# EAGLE design untitled (EAGLE 9.5.0)
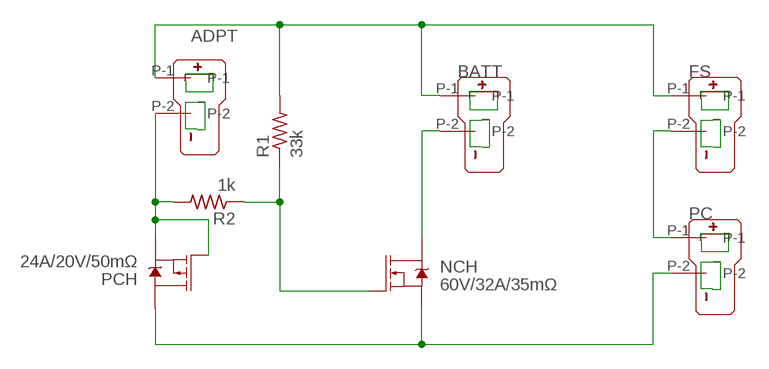
[diagram p0: schematic, sheet 1]

## Parts
ADPT  T-PLUG_CONNECTOR  [T_PLUG_CONNECTOR]
BATT  T-PLUG_CONNECTOR  [T_PLUG_CONNECTOR]
FS  T-PLUG_CONNECTOR  [T_PLUG_CONNECTOR]
NCH  60V/32A/35mΩ  MOSFET-NCH-FQP30N06L  [TO220V]
PC  T-PLUG_CONNECTOR  [T_PLUG_CONNECTOR]
PCH  24A/20V/50mΩ  MOSFET_PCH-NDP6020P  [TO220V]
R1  33k  R-US_0411/15  [0411/15]
R2  1k  R-US_0411/15  [0411/15]

## Nets
GND: NCH.3(S) PC.P-2 PCH.2(D)
N$1: NCH.1(G) R1.1 R2.1
N$2: ADPT.P-2 PCH.1(G) PCH.3(S) R2.2
N$4: BATT.P-2 NCH.2(D)
N$5: ADPT.P-1 BATT.P-1 FS.P-1 R1.2
N$6: FS.P-2 PC.P-1

## Library data of the parts
ADPT BATT FS PC = con-T-plug:T-PLUG_CONNECTOR
NCH = SparkFun-DiscreteSemi:MOSFET-NCH: N-channel MOSFETs Voltage controlled devices that allow control of high current outputs. SparkFun Products: SparkFun OpenScale <https://www.sparkfun.com/products/13261> SparkFun Digital Sandbox <https://www.sparkfun.com/products/12651> SparkFun Monster Moto Shield <https://www.sparkfun.com/products/10182> SparkFun MOSFET Power Controller <https://www.sparkfun.com/products/11214>; PROD_ID: TRANS-10060
PCH = SparkFun-DiscreteSemi:MOSFET_PCH: P-channel MOSFETs Voltage controlled devices that allow control of high current outputs. SparkFun Products: SparkFun ESP32 Thing <https://www.sparkfun.com/products/13907> SparkFun ESP8266 Thing <https://www.sparkfun.com/products/13231>; PROD_ID: TRANS-13060
R1 R2 = rcl:R-US_: RESISTOR, American symbol; SPICEPREFIX: R

## Board
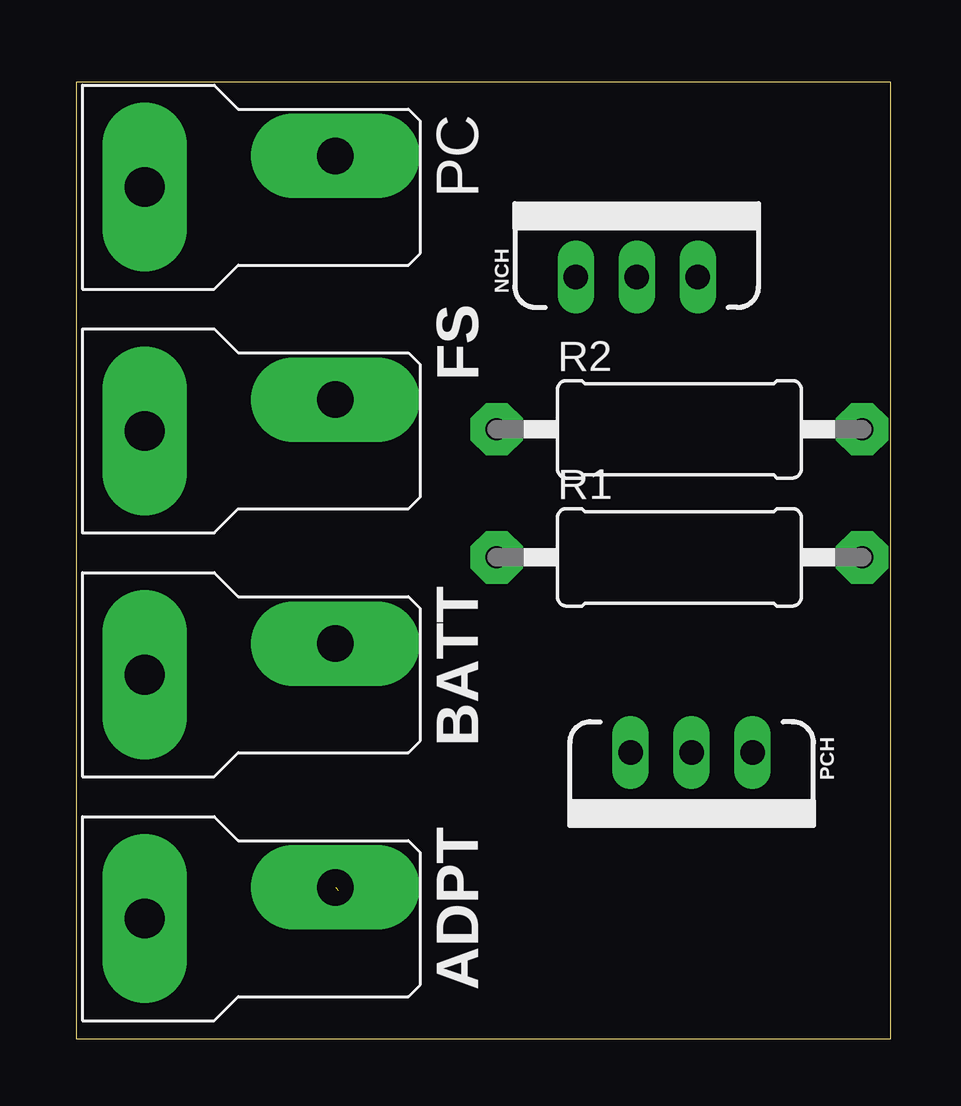
[diagram p1: board, top side]
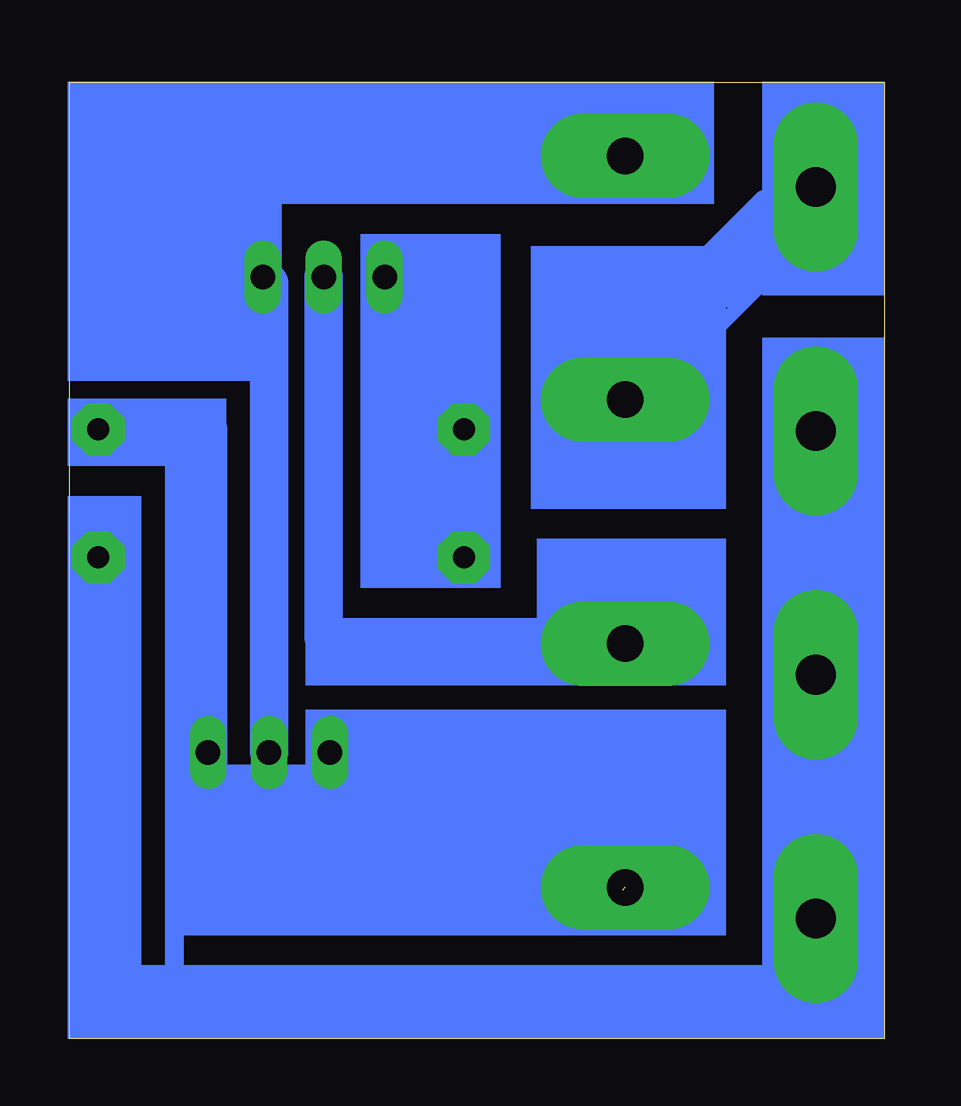
[diagram p2: board, bottom side, seen from below]

Size 33.96 x 39.87 mm. Coordinates in mm from the lower left corner, seen from the top.
Outline: 0,0 33.96,0 33.96,39.87 0,39.87 0,0
Copper layers (1*16): Top 0.035mm / dielectric 1.5mm / Bottom 0.035mm
Design rules "default *": minimum track width 6mil, minimum drill 0.35mm, track to track 32mil, track to pad 32mil, pad to pad 32mil, via to via 32mil, smd to smd 24mil, copper to edge 40mil, drill to drill 6mil, minimum pad ring 10mil, minimum via ring 8mil, stop-mask expansion 4mil, vias tented up to drill 0mil, thermal gap 10mil

### Footprints (pad centres in the part's own frame; a part is rotated, then mirrored left to right if it is on the bottom)
T_PLUG_CONNECTOR = drill 1.651 pad 3.531 long: P-1 2.6,4.248 | drill 1.524 pad 3.531 long: P-2 10.55,5.55
TO220V = drill 1.016 long: 1 -2.54,0; 2 0,0; 3 2.54,0
0411/15 = drill 0.914 pad 2.184 octagon: 1 -7.62,0; 2 7.62,0

### Placement (x,y rotation side)
ADPT  0.25,0.76 0 top
BATT  0.25,10.92 0 top
FS  0.25,21.08 0 top
NCH  23.37,31.75 0 top
PC  0.25,31.24 0 top
PCH  25.65,11.94 180 top
R1  25.15,20.07 0 top
R2  25.15,25.4 0 top

### Tracks (layer width: path | path; a pad name or v marks a point on that pad's centre or on a via)
GND
  Bottom 1.27: 9.44,36.79 PC.P-2
  Bottom 1.6: PC.P-2 15.12,36.79 17.15,38.82 24.17,38.82 25.91,37.08 NCH.3 25.65,31.5 PCH.2
N$1
  Bottom 1.27: 17.78,19.81 R1.1 | R2.1 17.78,25.15
  Bottom 1.6: 17.78,25.15 17.78,19.81 | R2.1 20.83,28.7 NCH.1
N$2  (1 unrouted)
  Bottom 1.27: 10.92,6.6 10.92,6.19 | ADPT.P-2 11.06,6.57
  Bottom 1.6: 23.11,6.57 11.06,6.57 | 23.11,6.57 26.89,6.57 28.19,7.87 PCH.1 28.19,25.4 R2.2 | PCH.3 23.11,6.57
N$3
  Bottom 0.61: 5.08,35.05 7.87,32.26
N$4
  Bottom 1.27: BATT.P-2 11.06,16.73
  Bottom 1.6: 11.06,16.73 23.37,16.73 NCH.2
N$5
  Bottom 1.27: 2.35,23.11 2.85,22.61
  Bottom 1.6: ADPT.P-1 2.85,2.29 32.77,2.29 R1.2
  Bottom 2.54: ADPT.P-1 2.85,14.28 3.3,14.73 2.86,15.17 | 2.86,15.17 BATT.P-1 | FS.P-1 2.85,22.61 2.85,15.18 2.86,15.17
N$6
  Bottom 2.54: PC.P-1 6.59,31.75 8.64,31.75 11.18,29.21 11.18,27 FS.P-2
N$7
  Bottom 0.61: 4.57,32 7.11,29.46 7.37,29.46
(copper drawn outside any net)
  shapes: Bottom area x21